# Altium schematic sheet pagea.SchDoc
size 381 x 241 mm
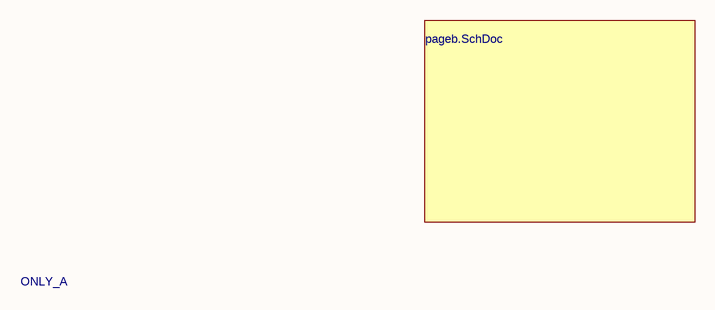
[diagram p0: pagea.SchDoc]

## Sub-sheets
? = pageb.SchDoc: SIG

## Notes on the sheet
- Labels drawn without touching a wire or pin: ONLY_A